# Altium project SmartToy_MainBoard_REV02.PrjPcb (part 1 of 3)
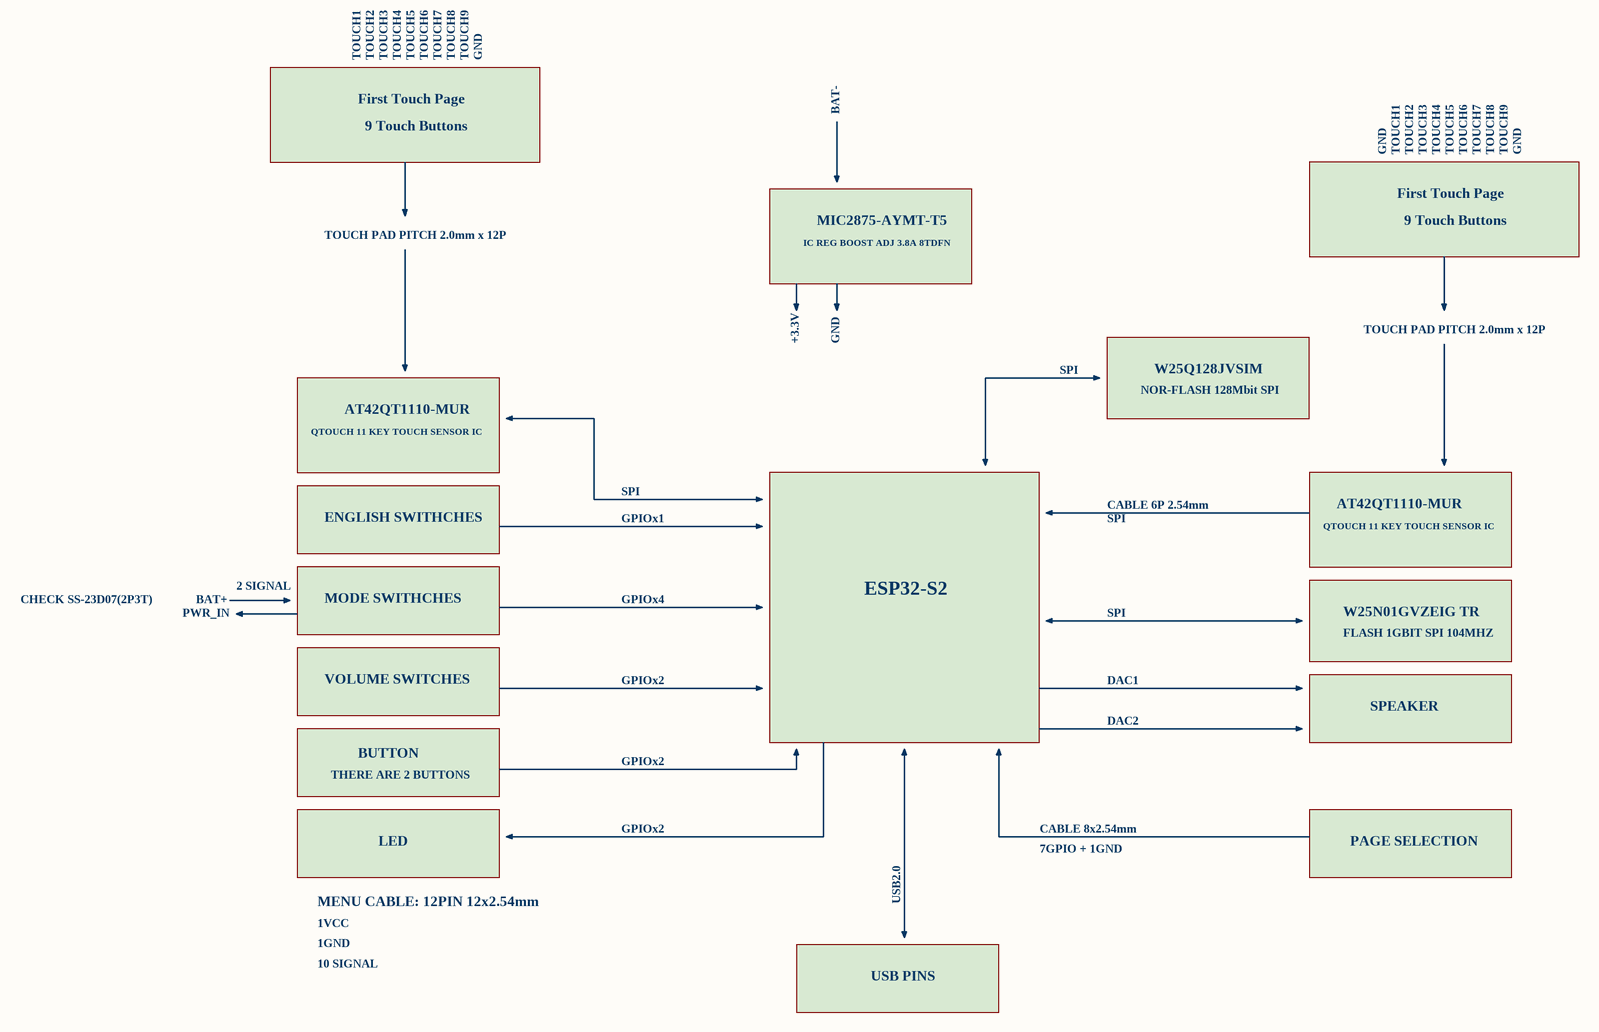
[diagram p0: SmartToy Main Board REV02 Block Diagram.SchDoc]
2 sheets, 120 parts. Net scope: global (net labels, ports and power ports of the same name join across sheets).
Board file: SmartToy_MainBoard_REV02 PCB.PcbDoc
Sheets:
  SmartToy Main Board REV02 Block Diagram.SchDoc
  SmartToy Main Board REV02 Schematic.SchDoc

## Sheet SmartToy Main Board REV02 Block Diagram.SchDoc: Smart Toy REV01 Block Diagram
size A3; DrawnBy: Manh Ngo Van; Engineer: Manh Ngo Van; Organization: Altium Limited; Address1: L3, 12a Rodborough Rd; Address2: Frenchs Forest; Address3: NSW; Address4: Australia 2086; DocumentNumber: 1; Revision: 1.0; SheetNumber: 1; SheetTotal: 2

### Notes on the sheet
- TOUCH1
- TOUCH2
- TOUCH3
- TOUCH4
- TOUCH5
- TOUCH6
- TOUCH7
- TOUCH8
- TOUCH9
- GND
- First Touch Page
- 9 Touch Buttons
- BAT-
- MIC2875-AYMT-T5
- TOUCH PAD PITCH 2.0mm x 12P
- IC REG BOOST ADJ 3.8A 8TDFN
- +3.3V
- AT42QT1110-MUR
- SPI
- NOR-FLASH 128Mbit SPI
- W25Q128JVSIM
- QTOUCH 11 KEY TOUCH SENSOR IC
- ENGLISH SWITHCHES
- GPIOx1
- CABLE 6P 2.54mm
- CHECK SS-23D07(2P3T)
- PWR_IN
- BAT+
- 2 SIGNAL
- MODE SWITHCHES
- GPIOx4
- ESP32-S2
- W25N01GVZEIG TR
- FLASH 1GBIT SPI 104MHZ
- VOLUME SWITCHES
- GPIOx2
- DAC1
- BUTTON
- DAC2
- SPEAKER
- THERE ARE 2 BUTTONS
- CABLE 8x2.54mm
- MENU CABLE: 12PIN 12x2.54mm
- LED
- USB2.0
- 7GPIO + 1GND
- PAGE SELECTION
- 1VCC
- 1GND
- 10 SIGNAL
- USB PINS
- Address: 90 Nguyen Tuan Street, Thanh Xuan
- Hanoi - Vietnam
- Title:
- Size
- Document Number:
- Engineer:
- Drawn By:
- Rev:
- Date:
- A3
- Sheet
- of

## Sheet SmartToy Main Board REV02 Schematic.SchDoc: Smart Toy Main Board REV01 Schematic
size A2; DrawnBy: Manh Ngo Van; Engineer: Manh Ngo Van; Organization: Altium Limited; Address1: L3, 12a Rodborough Rd; Address2: Frenchs Forest; Address3: NSW; Address4: Australia 2086; DocumentNumber: 2; Revision: 1.0; SheetNumber: 2; SheetTotal: 2
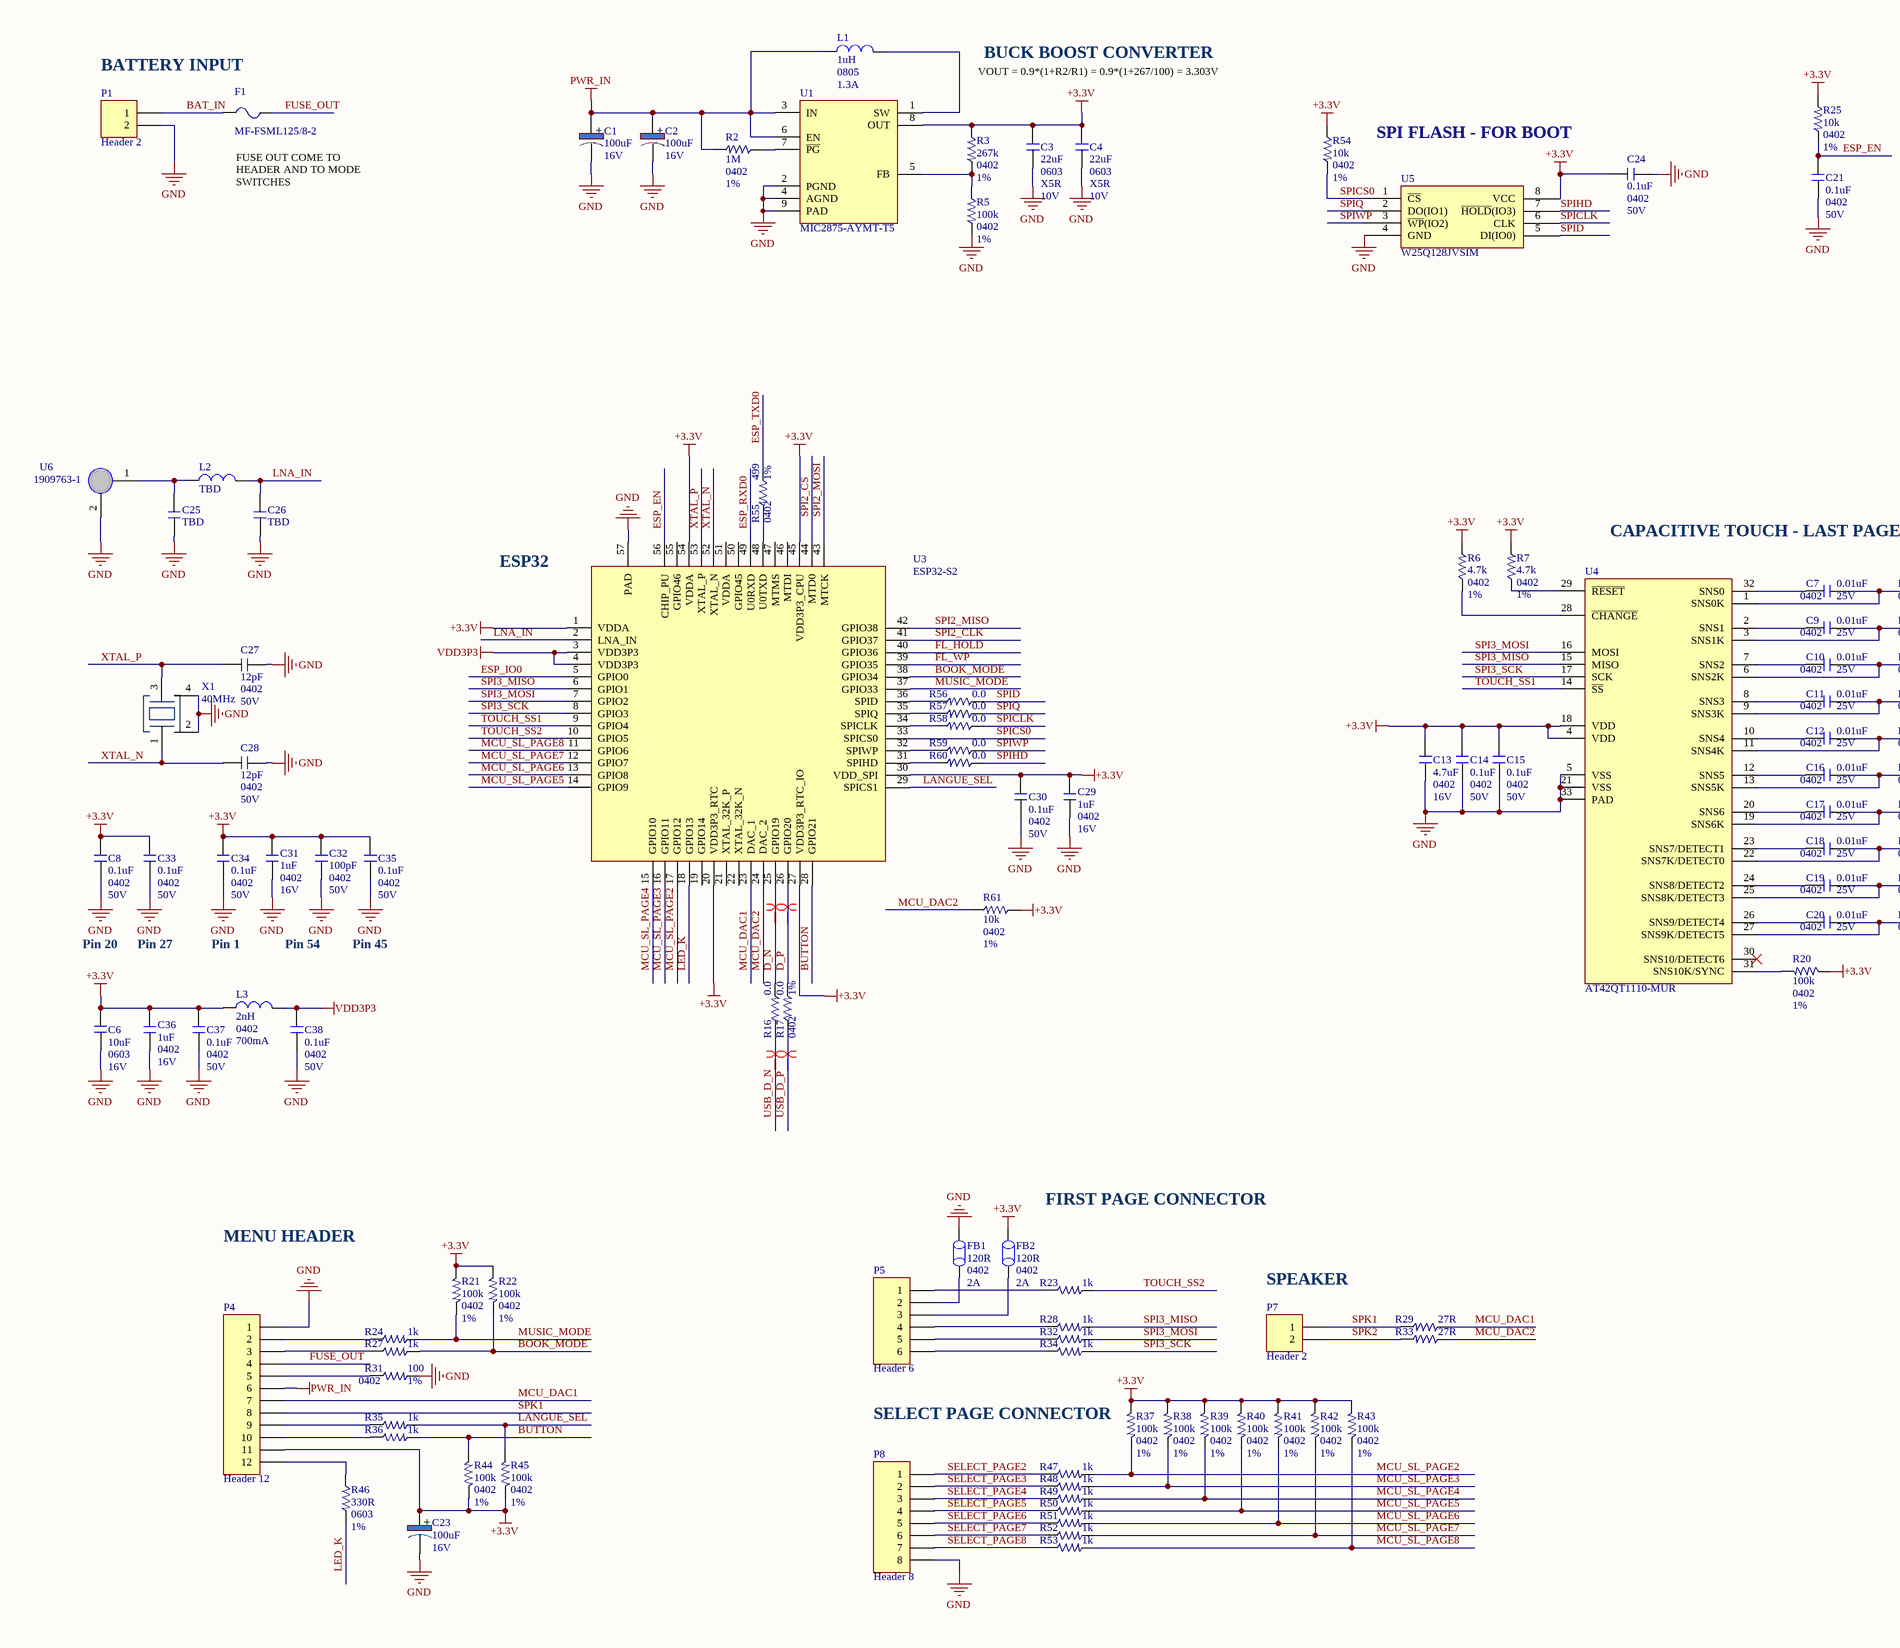
[diagram p1: SmartToy Main Board REV02 Schematic.SchDoc, left]
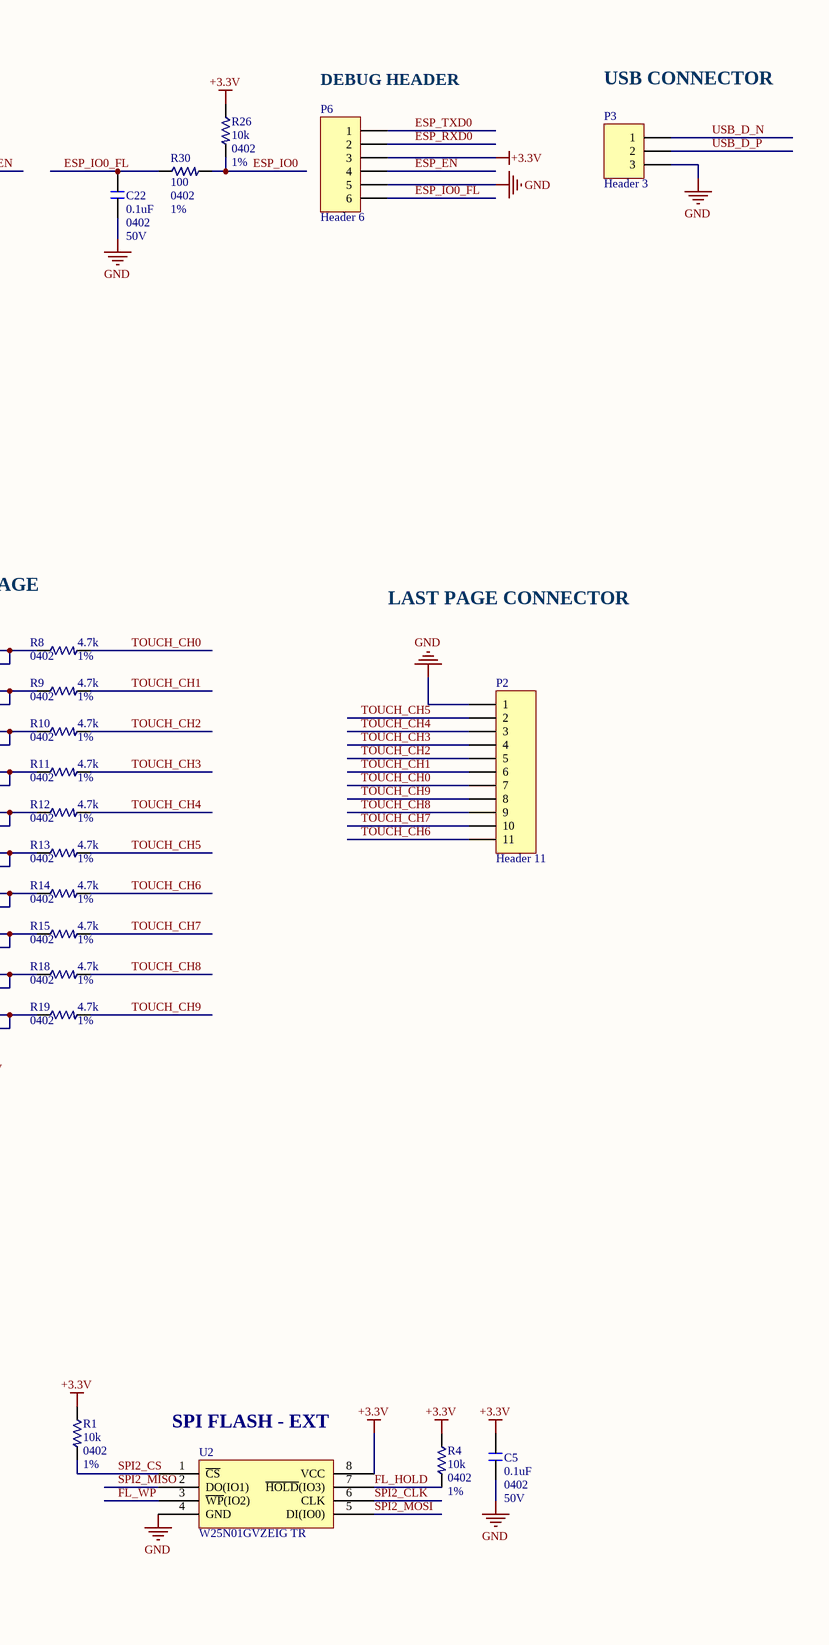
[diagram p2: SmartToy Main Board REV02 Schematic.SchDoc, right]

### Parts
C1  100uF  Voltage Rating: 16V  [CP_6.3X12.5_P2.5MM]
C2  100uF  Voltage Rating: 16V  [CP_6.3X12.5_P2.5MM]
C3  22uF  Case Code (Imperial): 0603  Dielectric: X5R  Voltage Rating: 10V  [C0603M]
C4  22uF  Case Code (Imperial): 0603  Dielectric: X5R  Voltage Rating: 10V  [C0603M]
C5  0.1uF  Case Code (Imperial): 0402  Voltage: 50V  [C0402M]
C6  10uF  Case/Package: 0603  Voltage Rating (DC): 16V  [C0603M]
C7  0.01uF  Case/Package: 0402  Voltage Rating: 25V  [C0402M]
C8  0.1uF  Case Code (Imperial): 0402  Voltage: 50V  [C0402M]
C9  0.01uF  Case/Package: 0402  Voltage Rating: 25V  [C0402M]
C10  0.01uF  Case/Package: 0402  Voltage Rating: 25V  [C0402M]
C11  0.01uF  Case/Package: 0402  Voltage Rating: 25V  [C0402M]
C12  0.01uF  Case/Package: 0402  Voltage Rating: 25V  [C0402M]
C13  4.7uF  Case/Package: 0402  Voltage Rating: 16V  [C0402M]
C14  0.1uF  Case/Package: 0402  Voltage: 50V  [C0402M]
C15  0.1uF  Case/Package: 0402  Voltage: 50V  [C0402M]
C16  0.01uF  Case/Package: 0402  Voltage Rating: 25V  [C0402M]
C17  0.01uF  Case/Package: 0402  Voltage Rating: 25V  [C0402M]
C18  0.01uF  Case/Package: 0402  Voltage Rating: 25V  [C0402M]
C19  0.01uF  Case/Package: 0402  Voltage Rating: 25V  [C0402M]
C20  0.01uF  Case/Package: 0402  Voltage Rating: 25V  [C0402M]
C21  0.1uF  Case Code (Imperial): 0402  Voltage: 50V  [C0402M]
C22  0.1uF  Case Code (Imperial): 0402  Voltage: 50V  [C0402M]
C23  100uF  Voltage Rating: 16V  [CP_6.3X12.5_P2.5MM]
C24  0.1uF  Case Code (Imperial): 0402  Voltage: 50V  [C0402M]
C25  TBD  [C0402M]
C26  TBD  [C0402M]
C27  12pF  Case/Package: 0402  Voltage Rating: 50V  [C0402M]
C28  12pF  Case/Package: 0402  Voltage Rating: 50V  [C0402M]
C29  1uF  Case/Package: 0402  Voltage Rating: 16V  [C0402M]
C30  0.1uF  Case Code (Imperial): 0402  Voltage: 50V  [C0402M]
C31  1uF  Case/Package: 0402  Voltage Rating: 16V  [C0402M]
C32  100pF  Case/Package: 0402  Voltage Rating (DC): 50V  [C0402M]
C33  0.1uF  Case Code (Imperial): 0402  Voltage: 50V  [C0402M]
C34  0.1uF  Case Code (Imperial): 0402  Voltage: 50V  [C0402M]
C35  0.1uF  Case Code (Imperial): 0402  Voltage: 50V  [C0402M]
C36  1uF  Case/Package: 0402  Voltage Rating: 16V  [C0402M]
C37  0.1uF  Case Code (Imperial): 0402  Voltage: 50V  [C0402M]
C38  0.1uF  Case Code (Imperial): 0402  Voltage: 50V  [C0402M]
F1  MF-FSML125/8-2  [R0603M]
FB1  120R  Case/Package: 0402  Current Rating: 2A  [R0402M]
FB2  120R  Case/Package: 0402  Current Rating: 2A  [R0402M]
L1  1uH  Case Code (Imperial): 0805  Current Rating: 1.3A  [IND_0805]
L2  TBD  [IND_0402]
L3  2nH  Case Code (Imperial): 0402  Current Rating: 700mA  [IND_0402]
P1  Header 2  [HDR1X2]  (no BOM)
P2  Header 11  [TOUCH_CONTACT_MAINBOARD]  (no BOM)
P3  Header 3  [HDR1X3]  (no BOM)
P4  Header 12  [HDR1X12]  (no BOM)
P5  Header 6  [HDR1X6]  (no BOM)
P6  Header 6  [HDR1X6]  (no BOM)
P7  Header 2  [HDR1X2]  (no BOM)
P8  Header 8  [HDR1X8]  (no BOM)
R1  10k  Case Code (Imperial): 0402  Tolerance: 1%  [R0402M]
R2  1M  Size Code: 0402  Tolerance: 1%  [R0402M]
R3  267k  Case/Package: 0402  Tolerance: 1%  [R0402M]
R4  10k  Case Code (Imperial): 0402  Tolerance: 1%  [R0402M]
R5  100k  Case/Package: 0402  Resistance Tolerance: 1%  [R0402M]
R6  4.7k  Case Code (Imperial): 0402  Tolerance: 1%  [R0402M]
R7  4.7k  Case Code (Imperial): 0402  Tolerance: 1%  [R0402M]
R8  4.7k  Case Code (Imperial): 0402  Tolerance: 1%  [R0402M]
R9  4.7k  Case Code (Imperial): 0402  Tolerance: 1%  [R0402M]
R10  4.7k  Case Code (Imperial): 0402  Tolerance: 1%  [R0402M]
R11  4.7k  Case Code (Imperial): 0402  Tolerance: 1%  [R0402M]
R12  4.7k  Case Code (Imperial): 0402  Tolerance: 1%  [R0402M]
R13  4.7k  Case Code (Imperial): 0402  Tolerance: 1%  [R0402M]
R14  4.7k  Case Code (Imperial): 0402  Tolerance: 1%  [R0402M]
R15  4.7k  Case Code (Imperial): 0402  Tolerance: 1%  [R0402M]
R16  0.0  [R0402M]
R17  0.0  Case Code (Imperial): 0402  Tolerance: 1%  [R0402M]
R18  4.7k  Case Code (Imperial): 0402  Tolerance: 1%  [R0402M]
R19  4.7k  Case Code (Imperial): 0402  Tolerance: 1%  [R0402M]
R20  100k  Case Code (Imperial): 0402  Tolerance: 1%  [R0402M]
R21  100k  Case Code (Imperial): 0402  Tolerance: 1%  [R0402M]
R22  100k  Case Code (Imperial): 0402  Tolerance: 1%  [R0402M]
R23  1k  [R0402M]
R24  1k  [R0402M]
R25  10k  Case Code (Imperial): 0402  Tolerance: 1%  [R0402M]
R26  10k  Case Code (Imperial): 0402  Tolerance: 1%  [R0402M]
R27  1k  [R0402M]
R28  1k  [R0402M]
R29  27R  [R0402M]
R30  100  Case Code (Imperial): 0402  Tolerance: 1%  [R0402M]
R31  100  Case Code (Imperial): 0402  Tolerance: 1%  [R0402M]
R32  1k  [R0402M]
R33  27R  [R0402M]
R34  1k  [R0402M]
R35  1k  [R0402M]
R36  1k  [R0402M]
R37  100k  Case Code (Imperial): 0402  Tolerance: 1%  [R0402M]
R38  100k  Case Code (Imperial): 0402  Tolerance: 1%  [R0402M]
R39  100k  Case Code (Imperial): 0402  Tolerance: 1%  [R0402M]
R40  100k  Case Code (Imperial): 0402  Tolerance: 1%  [R0402M]
R41  100k  Case Code (Imperial): 0402  Tolerance: 1%  [R0402M]
R42  100k  Case Code (Imperial): 0402  Tolerance: 1%  [R0402M]
R43  100k  Case Code (Imperial): 0402  Tolerance: 1%  [R0402M]
R44  100k  Case Code (Imperial): 0402  Tolerance: 1%  [R0402M]
R45  100k  Case Code (Imperial): 0402  Tolerance: 1%  [R0402M]
R46  330R  Case/Package: 0603  Tolerance: 1%  [R0603M]
R47  1k  [R0402M]
R48  1k  [R0402M]
R49  1k  [R0402M]
R50  1k  [R0402M]
R51  1k  [R0402M]
R52  1k  [R0402M]
R53  1k  [R0402M]
R54  10k  Case Code (Imperial): 0402  Tolerance: 1%  [R0402M]
R55  499  Case Code (Imperial): 0402  Resistance Tolerance: 1%  [R0402M]
R56  0.0  [R0402M]
R57  0.0  [R0402M]
R58  0.0  [R0402M]
R59  0.0  [R0402M]
R60  0.0  [R0402M]
R61  10k  Case Code (Imperial): 0402  Tolerance: 1%  [R0402M]
U1  MIC2875-AYMT-T5  [SON50P200X60_HS-9N]
U2  W25N01GVZEIG TR  [SON127P800X80_HS-9N]
U3  ESP32-S2  [QFN40P700X700X90_HS-57N]
U4  AT42QT1110-MUR  [QFN50P500X500X100_HS-33N]
U5  W25Q128JVSIM  [SOIC127P790X216-8N]
U6  1909763-1  [IPEX_ANT]
X1  40MHz  [FA-128]

### Nets
+3.3V: C3.2 C4.2 C5.2 C6.2 C8.2 C13.1 C14.1 C15.1 C23.1 C24.2 C29.2 C30.2 C31.2 C32.2 C33.2 C34.2 C35.2 C36.2 C37.2 FB2.1 L3.1 P4.11 P6.3 R1.2 R3.2 R4.2 R6.1 R7.1 R20.2 R21.2 R22.2 R25.2 R26.2 R37.2 R38.2 R39.2 R40.2 R41.2 R42.2 R43.2 R44.2 R45.2 R54.2 R61.2 U1.8(OUT) U2.8(VCC) U3.1(VDDA) U3.20(VDD3P3_RTC) U3.27(VDD3P3_RTC_IO) U3.30(VDD_SPI) U3.45(VDD3P3_CPU) U3.54(VDDA) U4.4(VDD) U4.18(VDD) U5.8(VCC)
GND: C1.2 C2.2 C3.1 C4.1 C5.1 C6.1 C8.1 C13.2 C14.2 C15.2 C21.1 C22.1 C23.2 C24.1 C25.1 C26.1 C27.1 C28.1 C29.1 C30.1 C31.1 C32.1 C33.1 C34.1 C35.1 C36.1 C37.1 C38.1 FB1.1 P1.2 P2.1 P3.3 P4.1 P6.5 P8.8 R5.1 R31.1 U1.2(PGND) U1.4(AGND) U1.9(PAD) U2.4(GND) U3.57(PAD) U4.5(VSS) U4.21(VSS) U4.33(PAD) U5.4(GND) U6.2(GND) X1.2 X1.4
PWR_IN: C1.1 C2.1 L1.1 P4.6 R2.1 U1.3(IN) U1.6(EN)
VDD3P3: C38.2 L3.2 U3.3(VDD3P3) U3.4(VDD3P3)
BAT_IN: F1.1 P1.1
BOOK_MODE: R22.1 R27.1 U3.38(GPIO34)
BUTTON: R36.1 R44.1 U3.28(GPIO21)
D_N: R16.1 U3.25(GPIO19)
D_P: R17.1 U3.26(GPIO20)
ESP_EN: C21.2 P6.4 R25.1 U3.56(CHIP_PU)
ESP_IO0: R26.1 R30.1 U3.5(GPIO0)
ESP_IO0_FL: C22.2 P6.6 R30.2
ESP_RXD0: P6.2 U3.49(U0RXD)
ESP_TXD0: P6.1 R55.2
FL_HOLD: R4.1 U2.7(~{HOLD}(IO3)) U3.40(GPIO36)
FL_WP: U2.3(~{WP}(IO2)) U3.39(GPIO35)
FUSE_OUT: F1.2 P4.4
LANGUE_SEL: R35.1 R45.1 U3.29(SPICS1)
LED_K: R46.1 U3.18(GPIO13)
LNA_IN: C26.2 L2.2 U3.2(LNA_IN)
MCU_DAC1: P4.7 R29.2 U3.23(DAC_1)
MCU_DAC2: R33.2 R61.1 U3.24(DAC_2)
MCU_SL_PAGE2: R37.1 R47.1 U3.17(GPIO12)
MCU_SL_PAGE3: R38.1 R48.1 U3.16(GPIO11)
MCU_SL_PAGE4: R39.1 R49.1 U3.15(GPIO10)
MCU_SL_PAGE5: R40.1 R50.1 U3.14(GPIO9)
MCU_SL_PAGE6: R41.1 R51.1 U3.13(GPIO8)
MCU_SL_PAGE7: R42.1 R52.1 U3.12(GPIO7)
MCU_SL_PAGE8: R43.1 R53.1 U3.11(GPIO6)
MUSIC_MODE: R21.1 R24.1 U3.37(GPIO33)
SELECT_PAGE2: P8.1 R47.2
SELECT_PAGE3: P8.2 R48.2
SELECT_PAGE4: P8.3 R49.2
SELECT_PAGE5: P8.4 R50.2
SELECT_PAGE6: P8.5 R51.2
SELECT_PAGE7: P8.6 R52.2
SELECT_PAGE8: P8.7 R53.2
SPI2_CLK: U2.6(CLK) U3.41(GPIO37)
SPI2_CS: R1.1 U2.1(~{CS}) U3.44(MTD0)
SPI2_MISO: U2.2(DO(IO1)) U3.42(GPIO38)
SPI2_MOSI: U2.5(DI(IO0)) U3.43(MTCK)
SPI3_MISO: R28.1 U3.6(GPIO1) U4.15(MISO)
SPI3_MOSI: R32.1 U3.7(GPIO2) U4.16(MOSI)
SPI3_SCK: R34.1 U3.8(GPIO3) U4.17(SCK)
SPICLK: R58.2 U5.6(CLK)
SPICS0: R54.1 U3.33(SPICS0) U5.1(~{CS})
SPID: R56.2 U5.5(DI(IO0))
SPIHD: R60.2 U5.7(~{HOLD}(IO3))
SPIQ: R57.2 U5.2(DO(IO1))
SPIWP: R59.2 U5.3(~{WP}(IO2))
SPK1: P4.8 P7.1 R29.1
SPK2: P7.2 R33.1
TOUCH_CH0: P2.7 R8.1
TOUCH_CH1: P2.6 R9.1
TOUCH_CH2: P2.5 R10.1
TOUCH_CH3: P2.4 R11.1
TOUCH_CH4: P2.3 R12.1
TOUCH_CH5: P2.2 R13.1
TOUCH_CH6: P2.11 R14.1
TOUCH_CH7: P2.10 R15.1
TOUCH_CH8: P2.9 R18.1
TOUCH_CH9: P2.8 R19.1
TOUCH_SS1: U3.9(GPIO4) U4.14(~{SS})
TOUCH_SS2: R23.1 U3.10(GPIO5)
USB_D_N: P3.1 R16.2
USB_D_P: P3.2 R17.2
XTAL_N: C28.2 U3.52(XTAL_N) X1.1
XTAL_P: C27.2 U3.53(XTAL_P) X1.3
NetC7_1: C7.1 R8.2 U4.1(SNS0K)
NetC7_2: C7.2 U4.32(SNS0)
NetC9_1: C9.1 R9.2 U4.3(SNS1K)
NetC9_2: C9.2 U4.2(SNS1)
NetC10_1: C10.1 R10.2 U4.6(SNS2K)
NetC10_2: C10.2 U4.7(SNS2)
NetC11_1: C11.1 R11.2 U4.9(SNS3K)
NetC11_2: C11.2 U4.8(SNS3)
NetC12_1: C12.1 R12.2 U4.11(SNS4K)
NetC12_2: C12.2 U4.10(SNS4)
NetC16_1: C16.1 R13.2 U4.13(SNS5K)
NetC16_2: C16.2 U4.12(SNS5)
NetC17_1: C17.1 R14.2 U4.19(SNS6K)
NetC17_2: C17.2 U4.20(SNS6)
NetC18_1: C18.1 R15.2 U4.22(SNS7K/DETECT0)
NetC18_2: C18.2 U4.23(SNS7/DETECT1)
NetC19_1: C19.1 R18.2 U4.25(SNS8K/DETECT3)
NetC19_2: C19.2 U4.24(SNS8/DETECT2)
NetC20_1: C20.1 R19.2 U4.27(SNS9K/DETECT5)
NetC20_2: C20.2 U4.26(SNS9/DETECT4)
NetC25_2: C25.2 L2.1 U6.1(SIG)
NetFB1_2: FB1.2 P5.2
NetFB2_2: FB2.2 P5.3
NetL1_2: L1.2 U1.1(SW)
NetP4_2: P4.2 R24.2
NetP4_3: P4.3 R27.2
NetP4_5: P4.5 R31.2
NetP4_9: P4.9 R35.2
NetP4_10: P4.10 R36.2
NetP4_12: P4.12 R46.2
NetP5_1: P5.1 R23.2
NetP5_4: P5.4 R28.2
NetP5_5: P5.5 R32.2
NetP5_6: P5.6 R34.2
NetR2_2: R2.2 U1.7(~{PG})
NetR3_1: R3.1 R5.2 U1.5(FB)
NetR6_2: R6.2 U4.28(~{CHANGE})
NetR7_2: R7.2 U4.29(~{RESET})
NetR20_1: R20.1 U4.31(SNS10K/SYNC)
NetR55_1: R55.1 U3.48(U0TXD)
NetR56_1: R56.1 U3.36(SPID)
NetR57_1: R57.1 U3.35(SPIQ)
NetR58_1: R58.1 U3.34(SPICLK)
NetR59_1: R59.1 U3.32(SPIWP)
NetR60_1: R60.1 U3.31(SPIHD)

Not connected (* = marked no-connect by the designer): U3 19(GPIO14) 21(XTAL_32K_P) 22(XTAL_32K_N) 46(MTDI) 47(MTMS) 50(GPIO45) 51(VDDA) 55(GPIO46); U4 30(SNS10/DETECT6)*

### Layout directives
differential pair; net class DIFF90: D_N, D_P, USB_D_N, USB_D_P

### Notes on the sheet
- BATTERY INPUT
- VOUT = 0.9*(1+R2/R1) = 0.9*(1+267/100) = 3.303V
- BUCK BOOST CONVERTER
- SPI FLASH - FOR BOOT
- (near P6) DEBUG HEADER
- (near P3) USB CONNECTOR
- (near F1) FUSE OUT COME TO HEADER AND TO MODE SWITCHES
- CAPACITIVE TOUCH - LAST PAGE
- LAST PAGE CONNECTOR
- (near U3) ESP32
- Pin 20
- Pin 27
- Pin 1
- Pin 54
- Pin 45
- MENU HEADER
- (near FB2) FIRST PAGE CONNECTOR
- (near P7) SPEAKER
- (near U2) SPI FLASH - EXT
- SELECT PAGE CONNECTOR
- Address: 90 Nguyen Tuan Street, Thanh Xuan
- Hanoi - Vietnam
- Title:
- Size
- Document Number:
- Engineer:
- Drawn By:
- Rev:
- Date:
- A2
- Sheet
- of